# Altium schematic sheet SERVMOD control.SchDoc: Kasli-DIOT
size 420 x 297 mm; EDA_Number: ARTIQ; Projet: ARTIQ/SINARA; Author: G.Kasprowicz; CompanyName: WUT ISE; DrawnBy: F.Świtakowski; Organization: WUT ISE; Address1: PW ISE; Address2: Nowowiejska 15/19 00-665 Warsaw; Address3: gkasprow@gmail.com; Revision: 1; SheetNumber: -; SheetTotal: -; ModifiedBy: -; CheckedDate: -; Title2: FPGA_I2C; DivGrp: WUT ISE; Designer: F.Świtakowski; ModifiedDate: -; ProjectName: Sensor Box
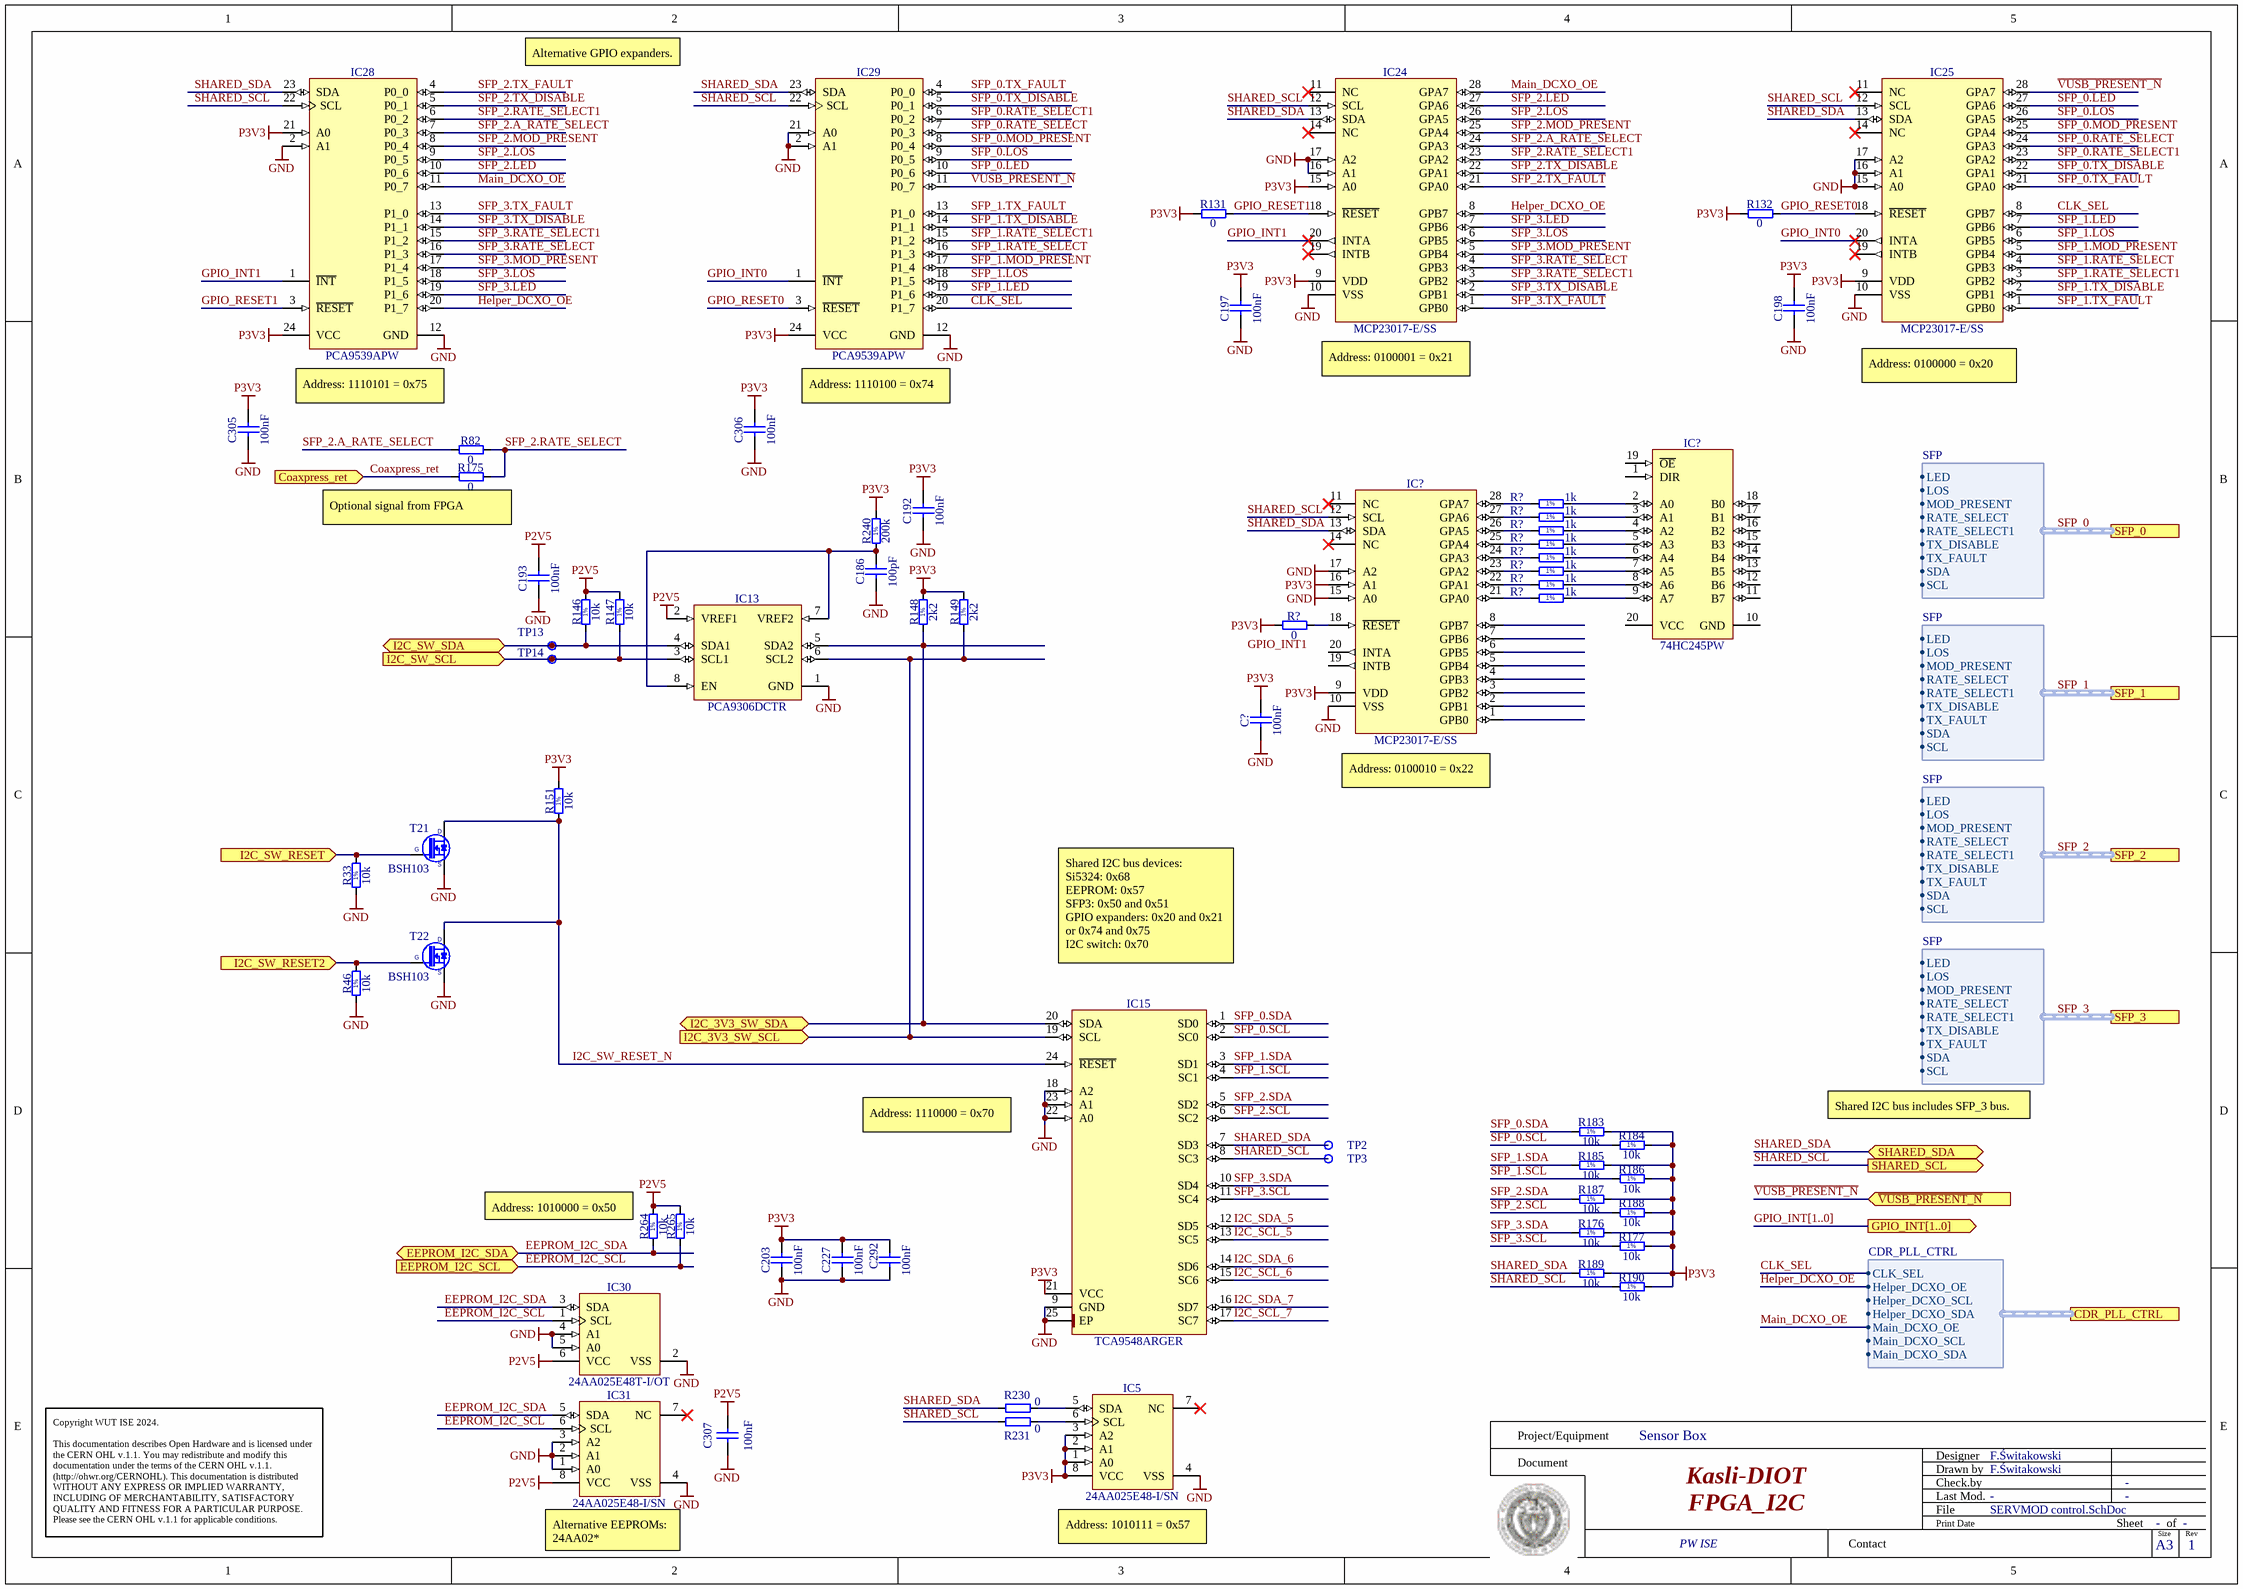
[diagram p0: SERVMOD control.SchDoc]

## Parts
(Parts that share a designator on the sheet are numbered #1, #2 ... from top to bottom, then left to right.)
C186  100pF  [CAPC1005X55N]
C192  100nF  [CAPC1005X55N]
C193  100nF  [CAPC1005X55N]
C197  100nF  [CAPC1005X55N]
C198  100nF  [CAPC1005X55N]
C203  100nF  [CAPC1005X55N]
C227  100nF  [CAPC1005X55N]
C292  100nF  [CAPC1005X55N]
C305  100nF  [CAPC1005X55N]
C306  100nF  [CAPC1005X55N]
C307  100nF  [CAPC1005X55N]
C?  100nF  [CAPC1005X55N]
IC5  24AA025E48-I/SN  [SOIC127P600X175-8N]
IC13  PCA9306DCTR  [SOP65P400X130-8N]
IC15  TCA9548ARGER  [QFN50P400X400X100-25N-S220]
IC24  MCP23017-E/SS  [SOP65P780X200-28N]
IC25  MCP23017-E/SS  [SOP65P780X200-28N]
IC28  PCA9539APW  [SOP65P640X110-24N]
IC29  PCA9539APW  [SOP65P640X110-24N]
IC30  24AA025E48T-I/OT  [SOT95P280X145-6N]
IC31  24AA025E48-I/SN  [SOIC127P600X175-8N]
IC?#1  74HC245PW  [SOP65P640X110-20N]
IC?#2  MCP23017-E/SS  [SOP65P780X200-28N]
R33  10k  [RESC1005X40N]
R46  10k  [RESC1005X40N]
R82  0  [RESC1005X40N]
R131  0  [RESC1005X40N]
R132  0  [RESC1005X40N]
R146  10k  [RESC1005X40N]
R147  10k  [RESC1005X40N]
R148  2k2  [RESC1005X40N]
R149  2k2  [RESC1005X40N]
R151  10k  [RESC1005X40N]
R175  0  [RESC1005X40N]
R176  10k  [RESC1005X40N]
R177  10k  [RESC1005X40N]
R183  10k  [RESC1005X40N]
R184  10k  [RESC1005X40N]
R185  10k  [RESC1005X40N]
R186  10k  [RESC1005X40N]
R187  10k  [RESC1005X40N]
R188  10k  [RESC1005X40N]
R189  10k  [RESC1005X40N]
R190  10k  [RESC1005X40N]
R230  0  [RESC1005X40N]
R231  0  [RESC1005X40N]
R240  200k  [RESC1005X40N]
R264  10k  [RESC1005X40N]
R265  10k  [RESC1005X40N]
R?#1  1k  [RESC1005X40N]
R?#2  1k  [RESC1005X40N]
R?#3  1k  [RESC1005X40N]
R?#4  1k  [RESC1005X40N]
R?#5  1k  [RESC1005X40N]
R?#6  1k  [RESC1005X40N]
R?#7  1k  [RESC1005X40N]
R?#8  1k  [RESC1005X40N]
R?#9  0  [RESC1005X40N]
T21  BSH103  [SOT95P230X110-3N]
T22  BSH103  [SOT95P230X110-3N]
TP2  Test Point  [TPS127]  (value not drawn)  (no BOM)
TP3  Test Point  [TPS127]  (value not drawn)  (no BOM)
TP13  Test Point  [TPS127]  (value not drawn)  (no BOM)
TP14  Test Point  [TPS127]  (value not drawn)  (no BOM)

## Ports
CDR_PLL_CTRL (harness CDR_PLL_CTRL), Coaxpress_ret (in), EEPROM_I2C_SCL (in), EEPROM_I2C_SDA (bidir), GPIO_INT[1..0] (out), I2C_3V3_SW_SCL (in), I2C_3V3_SW_SDA (bidir), I2C_SW_RESET2 (in), I2C_SW_RESET (in), I2C_SW_SCL (in), I2C_SW_SDA (bidir), SFP_0 (harness SFP), SFP_1 (harness SFP), SFP_2 (harness SFP), SFP_3 (harness SFP), SHARED_SCL (out), SHARED_SDA (bidir), ~{VUSB_PRESENT_N} (in)

## Harnesses
SFP: LED, LOS, MOD_PRESENT, RATE_SELECT, RATE_SELECT1, TX_DISABLE, TX_FAULT, SDA, SCL
CDR_PLL_CTRL: CLK_SEL, Helper_DCXO_OE, Helper_DCXO_SCL, Helper_DCXO_SDA, Main_DCXO_OE, Main_DCXO_SCL, Main_DCXO_SDA

## Nets
GND: C186.1 C192.1 C193.1 C197.1 C198.1 C203.1 C227.1 C292.1 C305.1 C306.1 C307.1 C?.1 IC5.4(VSS) IC13.1(GND) IC15.9(GND) IC15.18(A2) IC15.22(A0) IC15.23(A1) IC15.25(EP) IC24.10(VSS) IC24.16(A1) IC24.17(A2) IC25.10(VSS) IC25.15(A0) IC25.16(A1) IC25.17(A2) IC28.2(A1) IC28.12(GND) IC29.2(A1) IC29.12(GND) IC29.21(A0) IC30.2(VSS) IC30.4(A1) IC30.5(A0) IC31.1(A0) IC31.2(A1) IC31.3(A2) IC31.4(VSS) IC?#2.10(VSS) IC?#2.15(A0) IC?#2.17(A2) R33.1 R46.1 T21.2(S) T22.2(S)
P2V5: C193.2 C307.2 IC13.2(VREF1) IC30.6(VCC) IC31.8(VCC) R146.2 R147.2 R264.2 R265.2
P3V3: C192.2 C197.2 C198.2 C203.2 C227.2 C292.2 C305.2 C306.2 C?.2 IC5.1(A0) IC5.2(A1) IC5.3(A2) IC5.8(VCC) IC15.21(VCC) IC24.9(VDD) IC24.15(A0) IC25.9(VDD) IC28.21(A0) IC28.24(VCC) IC29.24(VCC) IC?#2.9(VDD) IC?#2.16(A1) R131.1 R132.1 R148.2 R149.2 R151.2 R176.2 R177.2 R183.2 R184.2 R185.2 R186.2 R187.2 R188.2 R189.2 R190.2 R240.2 R?#9.1
~{VUSB_PRESENT_N}: IC25.28(GPA7) IC29.11(P0_7) ; port ~{VUSB_PRESENT_N}
CLK_SEL: IC25.8(GPB7) IC29.20(P1_7) ; port CDR_PLL_CTRL.CLK_SEL
Coaxpress_ret: R175.1 ; port Coaxpress_ret
EEPROM_I2C_SCL: IC30.1(SCL) IC31.6(SCL) R265.1 ; port EEPROM_I2C_SCL
EEPROM_I2C_SDA: IC30.3(SDA) IC31.5(SDA) R264.1 ; port EEPROM_I2C_SDA
GPIO_INT0: IC25.20(INTA) IC29.1(~{INT})
GPIO_INT1: IC24.20(INTA) IC28.1(~{INT})
GPIO_RESET0: IC25.18(~{RESET}) IC29.3(~{RESET}) R132.2
GPIO_RESET1: IC24.18(~{RESET}) IC28.3(~{RESET}) R131.2
Helper_DCXO_OE: IC24.8(GPB7) IC28.20(P1_7) ; port CDR_PLL_CTRL.Helper_DCXO_OE
I2C_3V3_SW_SCL: IC13.6(SCL2) IC15.19(SCL) R149.1 ; port I2C_3V3_SW_SCL
I2C_3V3_SW_SDA: IC13.5(SDA2) IC15.20(SDA) R148.1 ; port I2C_3V3_SW_SDA
I2C_SCL_5: IC15.13(SC5)
I2C_SCL_6: IC15.15(SC6)
I2C_SCL_7: IC15.17(SC7)
I2C_SDA_5: IC15.12(SD5)
I2C_SDA_6: IC15.14(SD6)
I2C_SDA_7: IC15.16(SD7)
I2C_SW_RESET: R33.2 T21.1(G) ; port I2C_SW_RESET
I2C_SW_RESET2: R46.2 T22.1(G) ; port I2C_SW_RESET2
I2C_SW_RESET_N: IC15.24(~{RESET}) R151.1 T21.3(D) T22.3(D)
I2C_SW_SCL: IC13.3(SCL1) R147.1 TP14.1 ; port I2C_SW_SCL
I2C_SW_SDA: IC13.4(SDA1) R146.1 TP13.1 ; port I2C_SW_SDA
Main_DCXO_OE: IC24.28(GPA7) IC28.11(P0_7) ; port CDR_PLL_CTRL.Main_DCXO_OE
SFP_0.LED: IC25.27(GPA6) IC29.10(P0_6)
SFP_0.LOS: IC25.26(GPA5) IC29.9(P0_5)
SFP_0.MOD_PRESENT: IC25.25(GPA4) IC29.8(P0_4)
SFP_0.RATE_SELECT: IC25.24(GPA3) IC29.7(P0_3)
SFP_0.RATE_SELECT1: IC25.23(GPA2) IC29.6(P0_2)
SFP_0.SCL: IC15.2(SC0) R184.1
SFP_0.SDA: IC15.1(SD0) R183.1
SFP_0.TX_DISABLE: IC25.22(GPA1) IC29.5(P0_1)
SFP_0.TX_FAULT: IC25.21(GPA0) IC29.4(P0_0)
SFP_1.LED: IC25.7(GPB6) IC29.19(P1_6)
SFP_1.LOS: IC25.6(GPB5) IC29.18(P1_5)
SFP_1.MOD_PRESENT: IC25.5(GPB4) IC29.17(P1_4)
SFP_1.RATE_SELECT: IC25.4(GPB3) IC29.16(P1_3)
SFP_1.RATE_SELECT1: IC25.3(GPB2) IC29.15(P1_2)
SFP_1.SCL: IC15.4(SC1) R186.1
SFP_1.SDA: IC15.3(SD1) R185.1
SFP_1.TX_DISABLE: IC25.2(GPB1) IC29.14(P1_1)
SFP_1.TX_FAULT: IC25.1(GPB0) IC29.13(P1_0)
SFP_2.A_RATE_SELECT: IC24.24(GPA3) IC28.7(P0_3) R82.1
SFP_2.LED: IC24.27(GPA6) IC28.10(P0_6)
SFP_2.LOS: IC24.26(GPA5) IC28.9(P0_5)
SFP_2.MOD_PRESENT: IC24.25(GPA4) IC28.8(P0_4)
SFP_2.RATE_SELECT: R82.2 R175.2
SFP_2.RATE_SELECT1: IC24.23(GPA2) IC28.6(P0_2)
SFP_2.SCL: IC15.6(SC2) R188.1
SFP_2.SDA: IC15.5(SD2) R187.1
SFP_2.TX_DISABLE: IC24.22(GPA1) IC28.5(P0_1)
SFP_2.TX_FAULT: IC24.21(GPA0) IC28.4(P0_0)
SFP_3.LED: IC24.7(GPB6) IC28.19(P1_6)
SFP_3.LOS: IC24.6(GPB5) IC28.18(P1_5)
SFP_3.MOD_PRESENT: IC24.5(GPB4) IC28.17(P1_4)
SFP_3.RATE_SELECT: IC24.4(GPB3) IC28.16(P1_3)
SFP_3.RATE_SELECT1: IC24.3(GPB2) IC28.15(P1_2)
SFP_3.SCL: IC15.11(SC4) R177.1
SFP_3.SDA: IC15.10(SD4) R176.1
SFP_3.TX_DISABLE: IC24.2(GPB1) IC28.14(P1_1)
SFP_3.TX_FAULT: IC24.1(GPB0) IC28.13(P1_0)
SHARED_SCL: IC15.8(SC3) IC24.12(SCL) IC25.12(SCL) IC28.22(SCL) IC29.22(SCL) IC?#2.12(SCL) R190.1 R231.1 TP3.1 ; port SHARED_SCL
SHARED_SDA: IC15.7(SD3) IC24.13(SDA) IC25.13(SDA) IC28.23(SDA) IC29.23(SDA) IC?#2.13(SDA) R189.1 R230.1 TP2.1 ; port SHARED_SDA
NetC186_2: C186.2 IC13.7(VREF2) IC13.8(EN) R240.1
NetIC5_5: IC5.5(SDA) R230.2
NetIC5_6: IC5.6(SCL) R231.2
NetIC?#1_2: IC?#1.2(A0) R?#1.2
NetIC?#1_3: IC?#1.3(A1) R?#2.2
NetIC?#1_4: IC?#1.4(A2) R?#3.2
NetIC?#1_5: IC?#1.5(A3) R?#4.2
NetIC?#1_6: IC?#1.6(A4) R?#5.2
NetIC?#1_7: IC?#1.7(A5) R?#6.2
NetIC?#1_8: IC?#1.8(A6) R?#7.2
NetIC?#1_9: IC?#1.9(A7) R?#8.2
NetIC?#2_18: IC?#2.18(~{RESET}) R?#9.2
NetIC?#2_21: IC?#2.21(GPA0) R?#8.1
NetIC?#2_22: IC?#2.22(GPA1) R?#7.1
NetIC?#2_23: IC?#2.23(GPA2) R?#6.1
NetIC?#2_24: IC?#2.24(GPA3) R?#5.1
NetIC?#2_25: IC?#2.25(GPA4) R?#4.1
NetIC?#2_26: IC?#2.26(GPA5) R?#3.1
NetIC?#2_27: IC?#2.27(GPA6) R?#2.1
NetIC?#2_28: IC?#2.28(GPA7) R?#1.1

Not connected (* = marked no-connect by the designer): IC5 7(NC)*; IC24 11(NC)* 14(NC)* 19(INTB)*; IC25 11(NC)* 14(NC)* 19(INTB)*; IC31 7(NC)*; IC?#1 1(DIR) 10(GND) 11(B7) 12(B6) 13(B5) 14(B4) 15(B3) 16(B2) 17(B1) 18(B0) 19(~{OE}) 20(VCC); IC?#2 1(GPB0) 2(GPB1) 3(GPB2) 4(GPB3) 5(GPB4) 6(GPB5) 7(GPB6) 8(GPB7) 11(NC)* 14(NC)* 19(INTB) 20(INTA)

## Buses and harness runs
bus GPIO_INT[1..0] = port GPIO_INT[1..0]
harness SFP_0 = port SFP_0
harness SFP_1 = port SFP_1
harness SFP_2 = port SFP_2
harness SFP_3 = port SFP_3

## Notes on the sheet
- Alternative GPIO expanders.
- Address: 1110101 = 0x75
- Address: 1110100 = 0x74
- (near IC24) Address: 0100001 = 0x21
- (near IC25) Address: 0100000 = 0x20
- (near R175) Optional signal from FPGA
- (near IC?#2) Address: 0100010 = 0x22
- Shared I2C bus devices:
  Si5324: 0x68
  EEPROM: 0x57
  SFP3: 0x50 and 0x51
  GPIO expanders: 0x20 and 0x21 or 0x74 and 0x75
  I2C switch: 0x70
- Address: 1110000 = 0x70
- Shared I2C bus includes SFP_3 bus.
- (near R264) Address: 1010000 = 0x50
- (near IC5) Address: 1010111 = 0x57
- (near IC31) Alternative EEPROMs:
  24AA02*
- Labels drawn without touching a wire or pin: GPIO_INT1
- Project/Equipment
- Document
- Designer
- Drawn by
- Check.by
- Copyright WUT ISE 2024.
  This documentation describes Open Hardware and is licensed under the CERN OHL v.1.1. You may redistribute and modify this documentation under the terms of the CERN OHL v.1.1. (http://ohwr.org/CERNOHL). This documentation is distributed WITHOUT ANY EXPRESS OR IMPLIED WARRANTY, INCLUDING OF MERCHANTABILITY, SATISFACTORY QUALITY AND FITNESS FOR A PARTICULAR PURPOSE. Please see the CERN OHL v.1.1 for applicable conditions.
- Contact
- File
- Last Mod.
- Print Date
- Sheet
- Size
- A3
- of
- Rev
- (in symbol R0402_1K_1%_0.0625W_100PPM) 1%
- (in symbol R0402_2K2_1%_0.0625W_100PPM) 1%
- (in symbol R0402_10K_1%_0.0625W_100PPM) 1%
- (in symbol R0402_200K_1%_0.0625W_100PPM) 1%

## Library data of the parts
C186 = CC0402_100PF_50V_5%_C0G: Non-polarised capacitor; Part Description: SMD Multilayer Chip Ceramic Capacitor; Manufacturer: GENERIC; Manufacturer1 Part Number: C0402C101J5GACTU; Voltage: 50V; TC: C0G/NP0; Tolerance: ±5%; Part Number: CC0402_100PF_50V_5%_C0G; Component Kind: Standard; Component Type: Standard; Pin Count: 2; Value: 100pF; Status: Preferred; Manufacturer Part Number: CC0402_100PF_50V_5%_C0G; Case: 0402; Mounted: Yes; Socket: No; SMD: Yes; Sense: No; Manufacturer1 Example: KEMET; Manufacturer1 ComponentHeight: 0.55mm; HelpURL: \\cern.ch\dfs\Applications\Altium\Datasheets\CC0805_C0G_KEMET_(Commercial Grade).pdf; Author: CERN DEM JLC; CreateDate: 03.12.2007; LatestRevisionDate: 22.04.2015
C192 C193 C197 C198 C203 C227 C292 C305 C306 C? = CC0402_100NF_16V_10%_X7R: Non-polarised capacitor; Part Description: SMD Multilayer Chip Ceramic Capacitor; Manufacturer: GENERIC; Manufacturer1 Part Number: GRM155R71C104KA88D; Voltage: 16V; TC: X7R; Tolerance: ±10%; Part Number: CC0402_100NF_16V_10%_X7R; Component Kind: Standard; Component Type: Standard; Pin Count: 2; Value: 100nF; Status: Not Recommended; Manufacturer Part Number: CC0402_100NF_16V_10%_X7R; Case: 0402; Mounted: Yes; Socket: No; SMD: Yes; Sense: No; Manufacturer1 Example: MURATA; Manufacturer1 ComponentHeight: 0.55mm; HelpURL: \\cern.ch\dfs\Applications\Altium\Datasheets\CC0402_X7R_MURATA_GRM.pdf; Author: CERN DEM JLC; CreateDate: 05/12/2013; LatestRevisionDate: 03/12/2007
C307 = CC0402_100NF_16V_10%_X5R: Non-polarised capacitor; Part Description: SMD Multilayer Chip Ceramic Capacitor; Manufacturer: GENERIC; Manufacturer1 Part Number: GRM155R61C104KA88D; Voltage: 16V; TC: X5R; Tolerance: ±10%; Part Number: CC0402_100NF_16V_10%_X5R; Component Kind: Standard; Component Type: Standard; Pin Count: 2; Value: 100nF; Status: None; Manufacturer Part Number: CC0402_100NF_16V_10%_X5R; Case: 0402; Mounted: Yes; Socket: No; SMD: Yes; Sense: No; Manufacturer1 Example: MURATA; Manufacturer1 ComponentHeight: 0.55mm; HelpURL: \\cern.ch\dfs\Applications\Altium\Datasheets\CC0402_X5R_MURATA_GRM.pdf; Author: CERN DEM JLC; CreateDate: 2013-12-10; LatestRevisionDate: 2013-12-10
IC5 IC31 = 24AA025E48-I/SN: 1.7V-5.5V, 2K I2C™ Serial EEPROMs with EUI-48™ Node Identity; Manufacturer: MICROCHIP TECHNOLOGY; PressFit: No; Bonding: No; Part Number: 24AA025E48-I/SN; Component Kind: Standard; Component Type: Standard; Device: 24AA025E48-I/SN; Part Description: 1.7V-5.5V, 2K I2C™ Serial EEPROMs with EUI-48™ Node Identity; Manufacturer Part Number: 24AA025E48-I/SN; Pin Count: 8; Case: SOIC8; Mounted: Yes; Socket: No; SMD: Yes; Sense: No; ComponentHeight: 1.75mm; HelpURL: \\cern.ch\dfs\Applications\Altium\Datasheets\24AA025E48-I-SN.pdf; Author: CERN DEM MR
  IC5: PackageDescription: SOIC 8, Pitch 1.27mm - Body 4x5mm, IPC Medium Density; CreateDate: 19.07.2016; LatestRevisionDate: 19.07.2016
  IC31: PackageDescription: SOIC, 1.27mm Pitch; 8 Pin - Body 4x5mm, IPC Medium Density; CreateDate: 2016-07-19; LatestRevisionDate: 2016-07-19
IC13 = PCA9306DCTR: Dual Bidirectional I2C Bus And SMBus Voltage-Level Translator; Manufacturer: TEXAS INSTRUMENTS; PressFit: No; Bonding: No; Part Number: PCA9306DCTR; Component Kind: Standard; Component Type: Standard; Device: PCA9306DCTR; PackageDescription: SOP, 0.65mm, Pitch; 8 Pin, 2.80mm W X 2.95mm L X 1.30mm H Body, PC Medium Density; Part Description: Dual Bidirectional I2C Bus And SMBus Voltage-Level Translator; Manufacturer Part Number: PCA9306DCTR; Pin Count: 8; Case: SSOP8; Mounted: Yes; Socket: No; SMD: Yes; Sense: No; ComponentHeight: 1.3mm; Author: CERN DEM JLC; HelpURL: \\cern.ch\dfs\Applications\Altium\Datasheets\PCA9306DCTR.pdf; CreateDate: 25.02.2013; LatestRevisionDate: 11.02.2016
IC15 = TCA9548ARGER: Low Voltage 8-Channel I2C Switch With Reset; Manufacturer: TEXAS INSTRUMENTS; PressFit: No; Bonding: No; Part Number: TCA9548ARGER; Component Kind: Standard; Component Type: Standard; Device: TCA9548ARGER; PackageDescription: QFN, 0.50mm Pitch, Square; 24 Pin, 4.00mm L X 4.00mm W X 1.00mm H body (w/thermal tab 2.2 X 2.2mm), IPC Medium Density; Part Description: Low Voltage 8-Channel I2C Switch With Reset; Manufacturer Part Number: TCA9548ARGER; Pin Count: 25; Case: QFN24; Mounted: Yes; Socket: No; SMD: Yes; Sense: No; ComponentHeight: 1mm; Author: CERN DEM JLC; HelpURL: \\cern.ch\dfs\Applications\Altium\Datasheets\TCA9548ARGER.pdf; CreateDate: 07.07.2014; LatestRevisionDate: 07.07.2014
IC24 IC25 IC?#2 = MCP23017-E/SS: 16-bit I/O Port Expander With Serial Interface; Manufacturer: MICROCHIP TECHNOLOGY; PressFit: No; Bonding: No; Part Number: MCP23017-E/SS; Component Kind: Standard; Component Type: Standard; Device: MCP23017-E/SS; PackageDescription: SOP, 0.65mm Pitch; 28 pin, 5.30mm W X 10.20mm L X 2.00mm H body, IPC Medium Density; Part Description: 16-bit I/O Port Expander With Serial Interface; Manufacturer Part Number: MCP23017-E/SS; Pin Count: 28; Case: SSOP28; Mounted: Yes; Socket: No; SMD: Yes; Sense: No; ComponentHeight: 2mm; Author: CERN DEM JLC; HelpURL: \\cern.ch\dfs\Applications\Altium\Datasheets\MCP23017-E-SS.pdf; CreateDate: 2011-01-17; LatestRevisionDate: 2011-01-17
IC28 IC29 = PCA9539APW: Low-Voltage 16-Bit I2C-Bus I/O Port with Interrupt and Reset; Manufacturer: NXP SEMICONDUCTORS; PressFit: No; Bonding: No; Part Number: PCA9539APW; Component Kind: Standard; Component Type: Standard; Device: PCA9539APW; PackageDescription: SOP, 0.65mm Pitch; 24 Pin, 4.40mm W X 7.80mm L X 1.10mm H body, IPC Medium Density; Part Description: Low-Voltage 16-Bit I2C-Bus I/O Port with Interrupt and Reset; Manufacturer Part Number: PCA9539APW; Pin Count: 24; Case: TSSOP24; Mounted: Yes; Socket: No; SMD: Yes; Sense: No; ComponentHeight: 1.1mm; Author: CERN DEM JMW; HelpURL: \\cern.ch\dfs\Applications\Altium\Datasheets\PCA9539APW.pdf; CreateDate: 2020-08-06; LatestRevisionDate: 2020-08-06
IC30 = 24AA025E48T-I/OT: 1.7V-5.5V, 2K I2C Serial EEPROM With EUI-48 Node Identity; Part Description: 1.7V-5.5V, 2K I2C Serial EEPROM With EUI-48™ Node Identity; Cascadable; Manufacturer: MICROCHIP TECHNOLOGY; PressFit: No; Bonding: No; Part Number: 24AA025E48T-I/OT; Component Kind: Standard; Component Type: Standard; Device: 24AA025E48T-I/OT; PackageDescription: SOT, 0.95mm pitch; 6 pin, 1.60mm W X 2.90mm L X 1.45mm H body, IPC Medium Density; Manufacturer Part Number: 24AA025E48T-I/OT; Pin Count: 6; Case: SOT23-6; Mounted: Yes; Socket: No; SMD: Yes; Sense: No; ComponentHeight: 1.45mm; HelpURL: \\cern.ch\dfs\Applications\Altium\Datasheets\24AA025E48T-I-OT.pdf; Author: CERN DEM BC; CreateDate: 2019-12-06; LatestRevisionDate: 2019-12-06
IC?#1 = 74HC245PW: Octal Bi-Directional Transceiver with 3-State Inputs/Outputs; Part Description: Octal Bus Transceiver; 3-State; Manufacturer: NXP SEMICONDUCTORS; PressFit: No; Bonding: No; Part Number: 74HC245PW; Component Kind: Standard; Component Type: Standard; Device: 74HC245PW; PackageDescription: SOP, 20-Leads, Body 6.6x4.5mm (max), Pitch 0.65mm, IPC Medium Density; Manufacturer Part Number: 74HC245PW; Pin Count: 20; Case: TSSOP20; Mounted: Yes; Socket: No; SMD: Yes; Sense: No; ComponentHeight: 1.1mm; Author: CERN DEM MR; HelpURL: \\cern.ch\dfs\Applications\Altium\Datasheets\74HC245PW.pdf; CreateDate: 04.02.2016; LatestRevisionDate: 04.02.2016
R33 R46 R146 R147 R151 R176 R177 R183-R190 R264 R265 = R0402_10K_1%_0.0625W_100PPM: Resistor - 1%; Part Description: General Purpose Thick Film Chip Resistor; Manufacturer: GENERIC; Manufacturer1 Part Number: 232270671003L; TC: ±100ppm/°C; PressFit: No; Part Number: R0402_10K_1%_0.0625W_100PPM; Component Kind: Standard; Component Type: Standard; Pin Count: 2; Value: 10k; Status: Not Recommended; Power: 0.0625W; Tolerance: ±1%; Manufacturer Part Number: R0402_10K_1%_0.0625W_100PPM; Case: 0402; Mounted: Yes; Sense: No; Socket: No; SMD: Yes; Manufacturer1 Example: YAGEO PHYCOMP; Manufacturer1 ComponentHeight: 0.4mm; HelpURL: \\cern.ch\dfs\Applications\Altium\Datasheets\R0402_Phycomp_RC0402.pdf; Author: CERN DEM JLC; CreateDate: 03.12.2007; LatestRevisionDate: 17.10.2012
R82 R131 R132 R175 R230 R231 R?#9 = R0402_0R_JUMPER: Resistor; Part Description: 1A (0.05R Max DC Resistance) Zero Ohm Jumper; Manufacturer: GENERIC; Manufacturer1 Part Number: 232270591001L; PressFit: No; Part Number: R0402_0R_JUMPER; Component Kind: Standard; Component Type: Standard; Pin Count: 2; Value: 0; Status: Not Recommended; Manufacturer Part Number: R0402_0R_JUMPER; Case: 0402; Mounted: Yes; Sense: No; Socket: No; SMD: Yes; Manufacturer1 Example: YAGEO PHYCOMP; Manufacturer1 ComponentHeight: 0.4mm; HelpURL: \\cern.ch\dfs\Applications\Altium\Datasheets\R0402_Phycomp_RC0402.pdf; Author: CERN DEM JLC
  R82 R175 R230 R231: CreateDate: 03.12.2007; LatestRevisionDate: 17.10.2012
  R131 R132 R?#9: CreateDate: 2007-12-03; LatestRevisionDate: 2012-10-17
R148 R149 = R0402_2K2_1%_0.0625W_100PPM: Resistor - 1%; Part Description: General Purpose Thick Film Chip Resistor; Manufacturer: GENERIC; Manufacturer1 Part Number: 232270672202L; TC: ±100ppm/°C; PressFit: No; Part Number: R0402_2K2_1%_0.0625W_100PPM; Component Kind: Standard; Component Type: Standard; Pin Count: 2; Value: 2k2; Status: Not Recommended; Power: 0.0625W; Tolerance: ±1%; Manufacturer Part Number: R0402_2K2_1%_0.0625W_100PPM; Case: 0402; Mounted: Yes; Sense: No; Socket: No; SMD: Yes; Manufacturer1 Example: YAGEO PHYCOMP; Manufacturer1 ComponentHeight: 0.4mm; HelpURL: \\cern.ch\dfs\Applications\Altium\Datasheets\R0402_Phycomp_RC0402.pdf; Author: CERN DEM JLC; CreateDate: 03.12.2007; LatestRevisionDate: 17.10.2012
R240 = R0402_200K_1%_0.0625W_100PPM: Resistor - 1%; Part Description: General Purpose Thick Film Chip Resistor; Manufacturer: GENERIC; Manufacturer1 Part Number: 232270672004L; TC: ±100ppm/°C; PressFit: No; Part Number: R0402_200K_1%_0.0625W_100PPM; Component Kind: Standard; Component Type: Standard; Pin Count: 2; Value: 200k; Status: Not Recommended; Power: 0.0625W; Tolerance: ±1%; Manufacturer Part Number: R0402_200K_1%_0.0625W_100PPM; Case: 0402; Mounted: Yes; Sense: No; Socket: No; SMD: Yes; Manufacturer1 Example: YAGEO PHYCOMP; Manufacturer1 ComponentHeight: 0.4mm; HelpURL: \\cern.ch\dfs\Applications\Altium\Datasheets\R0402_Phycomp_RC0402.pdf; Author: CERN DEM JLC; CreateDate: 03.12.2007; LatestRevisionDate: 17.10.2012
R?#1-R?#8 = R0402_1K_1%_0.0625W_100PPM: Resistor - 1%; Part Description: General Purpose Thick Film Chip Resistor; Manufacturer: GENERIC; Manufacturer1 Part Number: 232270671002L; TC: ±100ppm/°C; PressFit: No; Part Number: R0402_1K_1%_0.0625W_100PPM; Component Kind: Standard; Component Type: Standard; Pin Count: 2; Value: 1k; Status: Not Recommended; Power: 0.0625W; Tolerance: ±1%; Manufacturer Part Number: R0402_1K_1%_0.0625W_100PPM; Case: 0402; Mounted: Yes; Sense: No; Socket: No; SMD: Yes; Manufacturer1 Example: YAGEO PHYCOMP; Manufacturer1 ComponentHeight: 0.4mm; HelpURL: \\cern.ch\dfs\Applications\Altium\Datasheets\R0402_Phycomp_RC0402.pdf; Author: CERN DEM JLC; CreateDate: 03.12.2007; LatestRevisionDate: 17.10.2012; ClassName: Artix
T21 T22 = BSH103: N-CHANNEL MOSFET WITH DIODE; Part Description: 30V 850mA N-Channel Enhancement Mode Field-Effect Transistor; Manufacturer: NEXPERIA; PressFit: No; Bonding: No; Part Number: BSH103; Component Kind: Standard; Component Type: Standard; Device: BSH103; PackageDescription: SOT23, 3 pin, Pitch 0.95mm - 1.3mm W X 2.9mm L X 1.1mm H, IPC Medium Density; Manufacturer Part Number: BSH103; Pin Count: 3; Case: SOT23-3; Mounted: Yes; Socket: No; SMD: Yes; Sense: No; ComponentHeight: 1.1mm; HelpURL: \\cern.ch\dfs\Applications\Altium\Datasheets\BSH103.pdf; Author: CERN DEM JLC; CreateDate: 16.03.2010; LatestRevisionDate: 20.06.2017; ClassName: Artix
TP2 TP3 TP13 TP14 = SMD_PAD_1.27X1.27MM: Part Description: 1.27mm x 1.27mm PCB Copper Area (SMD Test Point); Mounted: No; Part Number: SMD_PAD_1.27X1.27MM; Component Type: Standard (No BOM); Pin Count: 1; Family: Test Point; Socket: No; SMD: Yes; Sense: No; Status: None; ComponentHeight: 0mm; HelpURL: Undefined; Author: CERN DEM JLC; CreateDate: 12.01.2008; LatestRevisionDate: 12.01.2008; PackageDescription: 1.27mm x 1.27mm PCB Copper Area (SMD Test Point)